# Altium schematic sheet FIELD.SchDoc
size 420 x 297 mm; SheetNumber: 21; SheetTotal: 28; DocumentTypeShort: Э3; DocumentInvertoryNumber: ㅤ
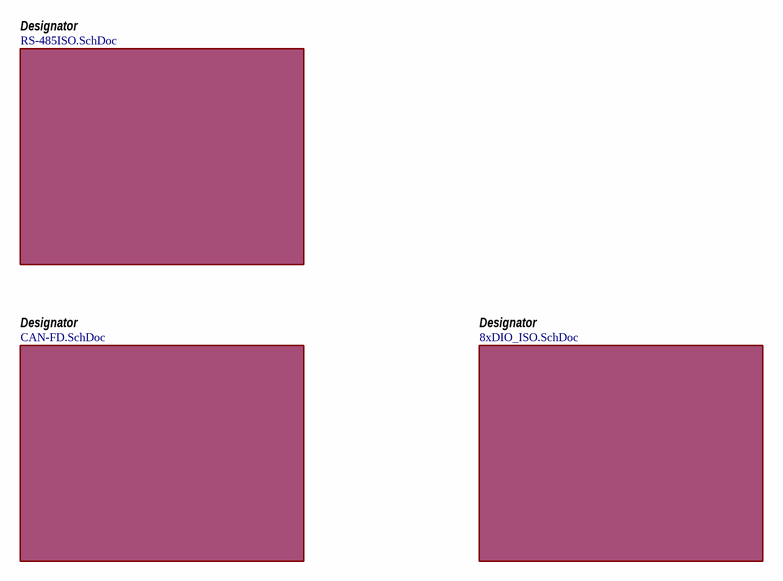
[diagram p0: FIELD.SchDoc]

## Sub-sheets
Designator = RS-485ISO.SchDoc: no entries
Designator = CAN-FD.SchDoc: no entries
Designator = 8xDIO_ISO.SchDoc: no entries

## Notes on the sheet
- Подп. и дата
- Инв. № дубл.
- Взам. инв. №
- Инв. № подл.
- Изм.
- Лист
- № докум.
- Подп.
- Дата
- Копировал
- Формат А3